# EAGLE design BiodataFeather_SymBioWare_001 (EAGLE 9.6.2)
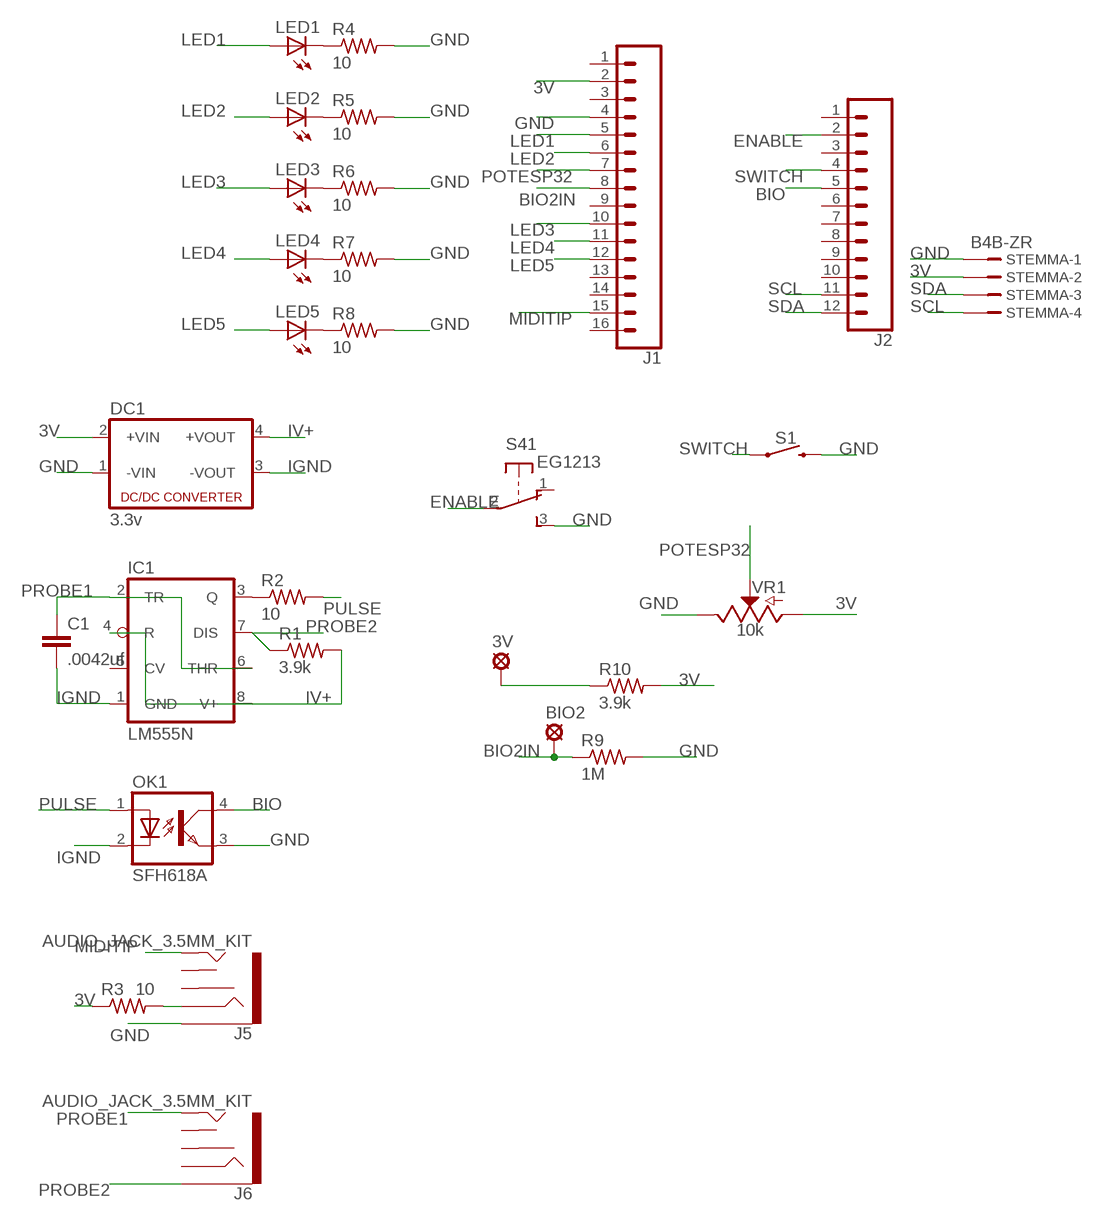
[diagram p0: schematic, sheet 1]

## Parts
3V  SE14  [SE14]
BIO2  SE14  [SE14]
C1  .0042uf  C2.5/2  [C2.5-2]
DC1  3.3v  NME  [NME]
IC1  LM555N  [DIL08]
J1  CONN_161X16_NO_SILK  [1X16_NO_SILK]
J2  CONN_12NO_SILK  [1X12_NO_SILK]
J5  AUDIO_JACK_3.5MM_KIT  [AUDIO-JACK-KIT]
J6  AUDIO_JACK_3.5MM_KIT  [AUDIO-JACK-KIT]
LED1  LED5MM  [LED5MM]
LED2  LED5MM  [LED5MM]
LED3  LED5MM  [LED5MM]
LED4  LED5MM  [LED5MM]
LED5  LED5MM  [LED5MM]
OK1  SFH618A  SFH618A-5  [DIP4]
R1  3.9k  R-US_0204/2V  [0204V]
R2  10  R-US_0204/2V  [0204V]
R3  10  R-US_0204/2V  [0204V]
R4  10  R-US_0204/2V  [0204V]
R5  10  R-US_0204/2V  [0204V]
R6  10  R-US_0204/2V  [0204V]
R7  10  R-US_0204/2V  [0204V]
R8  10  R-US_0204/2V  [0204V]
R9  1M  R-US_0204/2V  [0204V]
R10  3.9k  R-US_0204/2V  [0204V]
S1  MOMENTARY-SWITCH-SPST-PTH-6.0MM  [TACTILE_SWITCH_PTH_6.0MM]
S4  EG1213  [EG1213]
STEMMA  B4B-ZR  [B4B-ZR]
VR1  10k  POTENTIOMETER-PTH-9MM-1/20W-20%-KIT  [POT-PTH-ALPS-KIT]

## Nets
3V: DC1.2(+VIN) J1.2 R3.1 R10.2 STEMMA.2 VR1.P$3(A)
BIO: J2.5 OK1.4(COL)
BIO2IN: BIO2.MP J1.8 R9.1
ENABLE: J2.2 S4.2(1:P)
GND: DC1.1(-VIN) J1.4 J5.SLEEVE OK1.3(EMIT) R4.2 R5.2 R6.2 R7.2 R8.2 R9.2 S1.3 S4.3(1:S) STEMMA.1 VR1.P$1(E)
IGND: C1.2 DC1.3(-VOUT) IC1.1(GND) OK1.2(C)
IV+: DC1.4(+VOUT) IC1.4(R) IC1.8(V+) R1.2
LED1: J1.5 LED1.A
LED2: J1.6 LED2.A
LED3: J1.10 LED3.A
LED4: J1.11 LED4.A
LED5: J1.12 LED5.A
MIDITIP: J1.15 J5.TIP
N$1: IC1.3(Q) R2.1
N$2: J5.RING R3.2
N$3: LED1.K(C) R4.1
N$4: 3V.MP R10.1
N$8: LED2.K(C) R5.1
N$9: LED3.K(C) R6.1
N$10: LED4.K(C) R7.1
N$11: LED5.K(C) R8.1
POTESP32: J1.7 VR1.P$2(S)
PROBE1: C1.1 IC1.2(TR) IC1.6(THR) J6.TIP
PROBE2: IC1.7(DIS) J6.SLEEVE R1.1
PULSE: OK1.1(A) R2.2
SCL: J2.11 STEMMA.4
SDA: J2.12 STEMMA.3
SWITCH: J2.4 S1.1
Unconnected: IC1.5(CV) J1.1 J1.3 J1.9 J1.13 J1.14 J1.16 J2.1 J2.3 J2.6 J2.7 J2.8 J2.9 J2.10 J5.RSH J5.TSH J6.RING J6.RSH J6.TSH S4.1(1:O) S4.MT1(MT) S4.MT2(MT)

## Library data of the parts
3V BIO2 = solpad:SE14: SOLDER PAD E1553, drill 1,4mm, distributor Buerklin, 07F820
C1 = capacitor-wima:C: CAPACITOR naming: grid - package width
DC1 = dc-dc-converter:NME: DC-DC CONVERTER; MF: C & D TECHNOLOGIES, INC; MPN: NME1205D; OC_FARNELL: 1021466; OC_NEWARK: 98B8198
IC1 = linear:*555: TIMER
J1 = SparkFun-Connectors:CONN_16: Multi connection point. Often used as Generic Header-pin footprint for 0.1 inch spaced/style header connections On any of the 0.1 inch spaced packages, you can populate with these: Break Away Headers - Straight <https://www.sparkfun.com/products/116> (PRT-00116) Break Away Male Headers - Right Angle <https://www.sparkfun.com/products/553> (PRT-00553) Female Headers <https://www.sparkfun.com/products/115> (PRT-00115) Break Away Headers - Machine Pin <https://www.sparkfun.com/products/117> (PRT-00117) Break Away Female Headers - Swiss Machine Pin <https://www.sparkfun.com/products/743> (PRT-00743) For SCREWTERMINALS and SPRING TERMINALS visit here: Screw Terimnals on SparkFun.com <https://www.sparkfun.com/search/results?term=Screw+Terminals> (5mm/3.5mm/2.54mm spacing) This device is also useful as a general connection point to wire up your design to another part of your project. Our various solder wires solder well into these plated through hole pads. Hook-Up Wire - Assortment (Stranded, 22 AWG) <https://www.sparkfun.com/products/11375> (PRT-11375) Hook-Up Wire - Assortment (Solid Core, 22 AWG) <https://www.sparkfun.com/products/11367> (PRT-11367) View the entire wire category on our website here <https://www.sparkfun.com/categories/141> Special notes: Molex polarized connector foot print use with SKU : PRT-08231 with associated crimp pins and housings. 1MM SMD Version SKU: PRT-10208 NOTES ON THE VARIANTS LOCK and LOCK_LONGPADS... This footprint was designed to help hold the alignment of a through-hole component (i.e. 6-pin header) while soldering it into place. You may notice that each hole has been shifted either up or down by 0.005 of an inch from it's more standard position (which is a perfectly straight line). This slight alteration caused the pins (the squares in the middle) to touch the edges of the holes. Because they are alternating, it causes a "brace" to hold the component in place. 0.005 has proven to be the perfect amount of "off-center" position when using our standard breakaway headers. Although looks a little odd when you look at the bare footprint, once you have a header in there, the alteration is very hard to notice. Also,if you push a header all the way into place, it is covered up entirely on the bottom side.
J2 = SparkFun-Connectors:CONN_12: Multi connection point. Often used as Generic Header-pin footprint for 0.1 inch spaced/style header connections On any of the 0.1 inch spaced packages, you can populate with these: Break Away Headers - Straight <https://www.sparkfun.com/products/116> (PRT-00116) Break Away Male Headers - Right Angle <https://www.sparkfun.com/products/553> (PRT-00553) Female Headers <https://www.sparkfun.com/products/115> (PRT-00115) Break Away Headers - Machine Pin <https://www.sparkfun.com/products/117> (PRT-00117) Break Away Female Headers - Swiss Machine Pin <https://www.sparkfun.com/products/743> (PRT-00743) For SCREWTERMINALS and SPRING TERMINALS visit here: Screw Terimnals on SparkFun.com <https://www.sparkfun.com/search/results?term=Screw+Terminals> (5mm/3.5mm/2.54mm spacing) This device is also useful as a general connection point to wire up your design to another part of your project. Our various solder wires solder well into these plated through hole pads. Hook-Up Wire - Assortment (Stranded, 22 AWG) <https://www.sparkfun.com/products/11375> (PRT-11375) Hook-Up Wire - Assortment (Solid Core, 22 AWG) <https://www.sparkfun.com/products/11367> (PRT-11367) View the entire wire category on our website here <https://www.sparkfun.com/categories/141> Special notes: Molex polarized connector foot print use with SKU : PRT-08231 with associated crimp pins and housings. 1MM SMD Version SKU: PRT-10208 NOTES ON THE VARIANTS LOCK and LOCK_LONGPADS... This footprint was designed to help hold the alignment of a through-hole component (i.e. 6-pin header) while soldering it into place. You may notice that each hole has been shifted either up or down by 0.005 of an inch from it's more standard position (which is a perfectly straight line). This slight alteration caused the pins (the squares in the middle) to touch the edges of the holes. Because they are alternating, it causes a "brace" to hold the component in place. 0.005 has proven to be the perfect amount of "off-center" position when using our standard breakaway headers. Although looks a little odd when you look at the bare footprint, once you have a header in there, the alteration is very hard to notice. Also,if you push a header all the way into place, it is covered up entirely on the bottom side.
J5 J6 = SparkFun-Connectors:AUDIO_JACK_3.5MM: Audio Jack 3.5mm variants of PTH and SMT stereo audio jack with bypass switches. SparkFun Products: SparkFun SparkPunk Sound Kit <[https://www.sparkfun.com/products/11177]> - PTH MP3 Trigger <https://www.sparkfun.com/products/13720> -3.5mm SMD SparkFun PicoBoard <https://www.sparkfun.com/products/11888>- 2.5mm SMD; PROD_ID: CONN-08774; SF_ID: PRT-08032
LED1-LED5 = led:LED: LED OSRAM: - CHIPLED LG R971, LG N971, LY N971, LG Q971, LY Q971, LO R971, LY R971 LH N974, LH R974 LS Q976, LO Q976, LY Q976 LO Q996 - Hyper CHIPLED LW Q18S LB Q993, LB Q99A, LB R99A - SideLED LS A670, LO A670, LY A670, LG A670, LP A670 LB A673, LV A673, LT A673, LW A673 LH A674 LY A675 LS A676, LA A676, LO A676, LY A676, LW A676 LS A679, LY A679, LG A679 - Hyper Micro SIDELED® LS Y876, LA Y876, LO Y876, LY Y876 LT Y87S - SmartLED LW L88C, LW L88S LB L89C, LB L89S, LG L890 LS L89K, LO L89K, LY L89K LS L896, LA L896, LO L896, LY L896 - TOPLED LS T670, LO T670, LY T670, LG T670, LP T670 LSG T670, LSP T670, LSY T670, LOP T670, LYG T670 LG T671, LOG T671, LSG T671 LB T673, LV T673, LT T673, LW T673 LH T674 LS T676, LA T676, LO T676, LY T676, LB T676, LH T676, LSB T676, LW T676 LB T67C, LV T67C, LT T67C, LS T67K, LO T67K, LY T67K, LW E67C LS E67B, LA E67B, LO E67B, LY E67B, LB E67C, LV E67C, LT E67C LW T67C LS T679, LY T679, LG T679 LS T770, LO T770, LY T770, LG T770, LP T770 LB T773, LV T773, LT T773, LW T773 LH T774 LS E675, LA E675, LY E675, LS T675 LS T776, LA T776, LO T776, LY T776, LB T776 LHGB T686 LT T68C, LB T68C - Hyper Mini TOPLED® LB M676 - Mini TOPLED Santana® LG M470 LS M47K, LO M47K, LY M47K Source: http://www.osram.convergy.de LUXEON: - LUMILED® LXK2-PW12-R00, LXK2-PW12-S00, LXK2-PW14-U00, LXK2-PW14-V00 LXK2-PM12-R00, LXK2-PM12-S00, LXK2-PM14-U00 LXK2-PE12-Q00, LXK2-PE12-R00, LXK2-PE12-S00, LXK2-PE14-T00, LXK2-PE14-U00 LXK2-PB12-K00, LXK2-PB12-L00, LXK2-PB12-M00, LXK2-PB14-N00, LXK2-PB14-P00, LXK2-PB14-Q00 LXK2-PR12-L00, LXK2-PR12-M00, LXK2-PR14-Q00, LXK2-PR14-R00 LXK2-PD12-Q00, LXK2-PD12-R00, LXK2-PD12-S00 LXK2-PH12-R00, LXK2-PH12-S00 LXK2-PL12-P00, LXK2-PL12-Q00, LXK2-PL12-R00 Source: www.luxeon.com KINGBRIGHT: KA-3528ASYC Source: www.kingbright.com
OK1 = optocoupler:SFH618?*: Optocoupler, Phototransistor Output, Low Input Current Source: Data sheet <http://www.vishay.com/docs/83673/sfh618.pdf>; MF: VISHAY/TELEFUNKEN; MPN: SFH618A-5; OC_FARNELL: 1469593; OC_NEWARK: 59K0259
R1-R10 = rcl:R-US_: RESISTOR, American symbol
S1 = SparkFun-Switches:MOMENTARY-SWITCH-SPST: Momentary Switch (Pushbutton) - SPST Normally-open (NO) SPST momentary switches (buttons, pushbuttons). Variants PTH-12MM - 12mm square, through-hole Momentary Pushbutton Switch - 12mm Square <https://www.sparkfun.com/products/9190> (COM-09190) PTH-6.0MM, PTH-6.0MM-KIT - 6.0mm square, through-hole Mini Pushbutton Switch <https://www.sparkfun.com/products/97> (COM-00097) KIT package intended for soldering kit's - only one side of pads' copper is exposed. PTH-RIGHT-ANGLE-KIT - Right-angle, through-hole Right Angle Tactile Button <https://www.sparkfun.com/products/10791> - Used on SparkFun BigTime Watch Kit <https://www.sparkfun.com/products/11734> SMD-12MM - 12mm square, surface-mount Tactile Button - SMD (12mm) <https://www.sparkfun.com/products/12993> (COM-12993) Used on SparkFun PicoBoard <https://www.sparkfun.com/products/11888> SMD-4.5MM - 4.5mm Square Trackball Switch Used on SparkFun Blackberry Trackballer Breakout <https://www.sparkfun.com/products/13169> SMD-4.6MMX2.8MM - 4.60mm x 2.80mm, surface mount Used on SparkFun SAMD21 Mini Breakout <https://www.sparkfun.com/products/13664> SMD-5.2MM, SMD-5.2-REDUNDANT - 5.2mm square, surface-mount Mini Pushbutton Switch - SMD <https://www.sparkfun.com/products/8720> (COM-08720) Used on Arduino Pro Mini <https://www.sparkfun.com/products/11114> REDUNDANT package connects both switch circuits together SMD-6.0X3.5MM - 6.0 x 3.5mm, surface mount Momentary Reset Switch SMD <https://www.sparkfun.com/products/8229> (COM-08229) SMD-6.2MM-TALL - 6.2mm square, surface mount Tactile Button - SMD (6mm) <https://www.sparkfun.com/products/12992> Used on SparkFun Digital Sandbox <https://www.sparkfun.com/products/12651> SMD-RIGHT-ANGLE - Right-angle, surface mount Used on SparkFun Block for Intel® Edison - Arduino <https://www.sparkfun.com/products/13036>; PROD_ID: SWCH-08441; SF_SKU: COM-00097
S4 = adafruit:EG1213: E-Switch right-angle slide SPDT Part #EG1213 http://www.ladyada.net/library/eagle
STEMMA = con-jst:?4B-ZR: ZH CONNECTOR 1.5 mm, 4 pin 1 row Source: http://www.jst.com .. eZH.pdf; MF: FARNELL; MPN: B4B-ZR(LF)(SN); OC_FARNELL: 1830916; OC_NEWARK: 37K9960
VR1 = SparkFun-Resistors:POTENTIOMETER: Potentiometer (Pot) Three-terminal potentiometers, with an adjustable wiper and two adjustable resistors. A pot can be used to create a configurable voltage divider, or as a variable resistor. Variants ALPS_POT and ALPS_POT_KIT - PTH, breadboard compatible, 9mm square pots Rotary Potentiometer - Linear (10k ohm) <https://www.sparkfun.com/products/9288> (COM-09288) The KIT variant exposes copper on only one side of the PTH pad, so the part can only be assembled on one side of the PCB. Useful for beginner soldering kits.; PROD_ID: RES-09177; SF_SKU: COM-09288

## Board
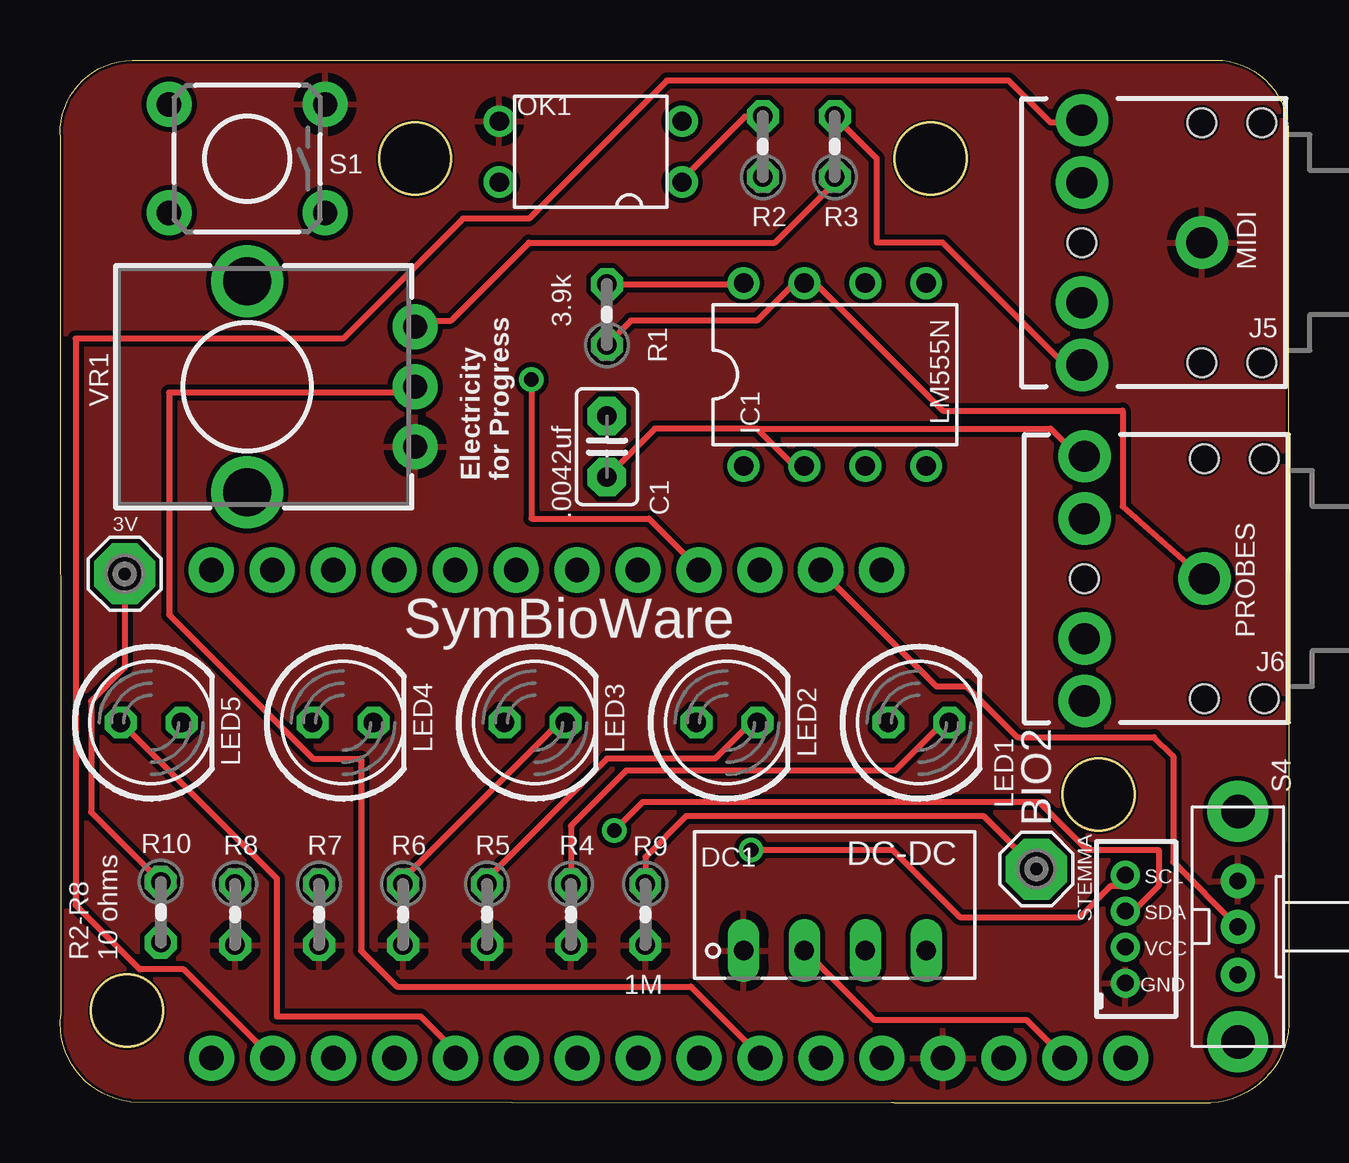
[diagram p1: board, top side]
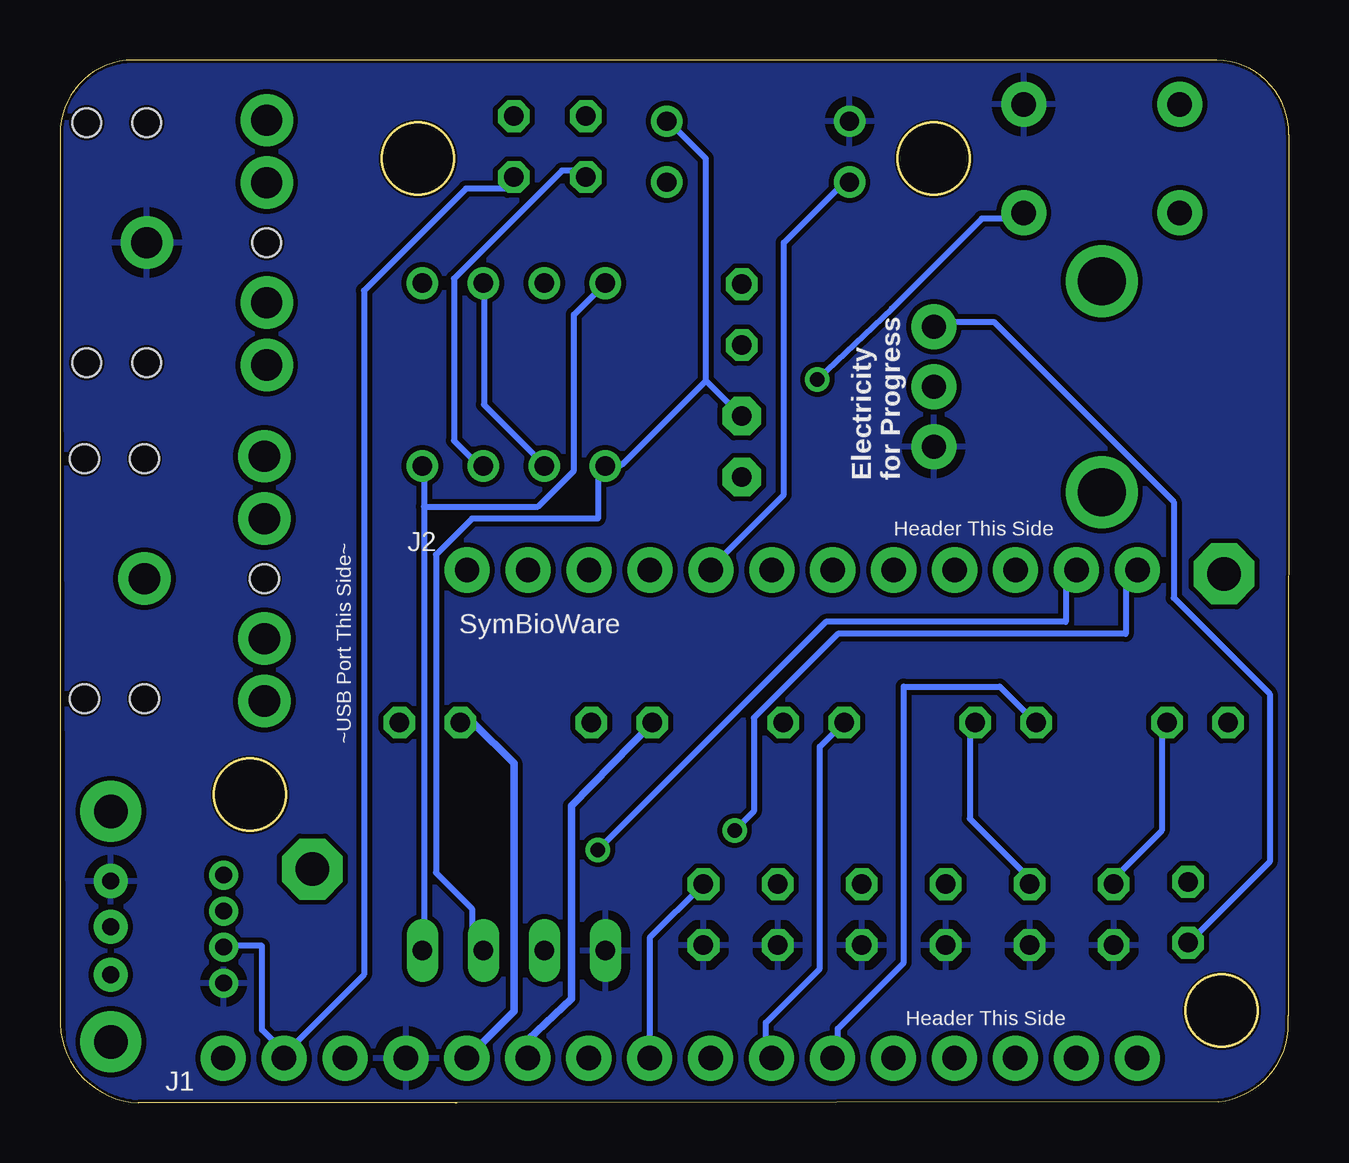
[diagram p2: board, bottom side, seen from below]

Size 51.22 x 43.45 mm. Coordinates in mm from the lower left corner, seen from the top.
Outline: 34.76,0 2.93,0.05 arc-90 0.03,3.62 0,40.34 arc-90 3,43.44 47.9,43.44 arc-90 51.2,40.64 51.22,3.58 arc-90 47.96,0 34.76,0
Outline: 34.76,0 34.66,0
Outline: circle at 14.8,39.34 radius 1.5
Outline: circle at 36.3,39.34 radius 1.5
Outline: circle at 43.3,12.84 radius 1.5
Outline: circle at 2.8,3.84 radius 1.5
Copper layers (1*16): Top 0.035mm / dielectric 1.5mm / Bottom 0.035mm
Design rules "default *": minimum track width 10mil, minimum drill 24mil, track to track 8mil, track to pad 8mil, pad to pad 8mil, via to via 8mil, smd to smd 8mil, copper to edge 5mil, drill to drill 8mil, minimum pad ring 10mil, minimum via ring 8mil, stop-mask expansion 4mil, vias tented up to drill 0mil, thermal gap 15mil

### Footprints (pad centres in the part's own frame; a part is rotated, then mirrored left to right if it is on the bottom)
SE14 = drill 1.397 pad 2.54 octagon: MP 0,0
C2.5-2 = drill 0.813 pad 1.6 octagon: 1 -1.27,0; 2 1.27,0
NME = drill 0.813 long: 1 0,3.81; 2 0,1.27; 3 0,-1.27; 4 0,-3.81
DIL08 = drill 0.813 pad 1.27: 1 -3.81,-3.81; 2 -1.27,-3.81; 3 1.27,-3.81; 4 3.81,-3.81; 5 3.81,3.81; 6 1.27,3.81; 7 -1.27,3.81; 8 -3.81,3.81
1X16_NO_SILK = drill 1.016 pad 1.88: 1 0,0; 2 2.54,0; 3 5.08,0; 4 7.62,0; 5 10.16,0; 6 12.7,0; 7 15.24,0; 8 17.78,0; 9 20.32,0; 10 22.86,0; 11 25.4,0; 12 27.94,0; 13 30.48,0; 14 33.02,0; 15 35.56,0; 16 38.1,0
1X12_NO_SILK = drill 1.016 pad 1.88: 1 0,0; 2 2.54,0; 3 5.08,0; 4 7.62,0; 5 10.16,0; 6 12.7,0; 7 15.24,0; 8 17.78,0; 9 20.32,0; 10 22.86,0; 11 25.4,0; 12 27.94,0
AUDIO-JACK-KIT = drill 1.3 pad 2.184: RING 5,5.1; RSH 5,2.5; SLEEVE 0,0; TIP 5,-5.1; TSH 5,-2.5 | hole 1.2: 0,5; -2.5,5; -2.5,-5; 0,-5; 5,0
LED5MM = drill 0.813 octagon: A -1.27,0; K 1.27,0
DIP4 = drill 0.8: 1 -1.27,-3.81; 2 1.27,-3.81; 3 1.27,3.81; 4 -1.27,3.81
0204V = drill 0.813 octagon: 1 -1.27,0; 2 1.27,0
TACTILE_SWITCH_PTH_6.0MM = drill 1.016 pad 1.88: 1 -3.251,2.261; 2 3.251,2.261; 3 -3.251,-2.261; 4 3.251,-2.261
EG1213 = drill 0.7 pad 1.422: 1 -2,0; 2 0,0; 3 1.9,0 | drill 1.4 pad 2.54: MT1 -4.8,0; MT2 4.8,0
B4B-ZR = drill 0.7 pad 1.1: 1 -2.25,0; 2 -0.75,0; 3 0.75,0; 4 2.25,0
POT-PTH-ALPS-KIT = drill 1 pad 1.88: P$1 7,-2.5; P$2 7,0; P$3 7,2.5 | drill 2: P$4 0,-4.4; P$5 0,4.4

### Placement (x,y rotation side)
3V  2.7,22.04 0 top
BIO2  40.7,9.74 0 top
C1  22.8,27.34 90 top
DC1  32.3,6.34 90 top
IC1  32.3,30.34 0 top
J1  44.42,1.86 180 top
J2  34.25,22.2 180 top
J5  47.6,35.84 180 top
J6  47.7,21.84 180 top
LED1  35.8,15.84 0 top
LED2  27.8,15.84 0 top
LED3  19.8,15.84 0 top
LED4  11.8,15.84 0 top
LED5  3.8,15.84 0 top
OK1  22.12,39.63 90 top
R1  22.8,32.84 90 top
R2  29.3,39.84 90 top
R3  32.3,39.84 90 top
R4  21.3,7.84 270 top
R5  17.8,7.84 270 top
R6  14.3,7.84 270 top
R7  10.8,7.84 270 top
R8  7.3,7.84 270 top
R9  24.4,7.84 270 top
R10  4.2,7.94 270 top
S1  7.8,39.34 180 top
S4  49.1,7.34 90 top
STEMMA  44.4,7.24 90 top
VR1  7.8,29.84 0 top

### Tracks (layer width: path | path; a pad name or v marks a point on that pad's centre or on a via)
3V
  Top 0.254: J1.2 40.3,3.44 33.95,3.44 31.05,6.34 DC1.2 | VR1.P$3 15.05,32.59 16.3,32.59 19.55,35.84 29.8,35.84 32.3,38.34 R3.1
  Bottom 0.254: R3.1 32.3,38.09 34.3,38.09 38.55,33.84 38.55,5.34 41.8,2.09 J1.2 42.3,2.04 42.3,2.54 42.8,3.04 42.8,6.54 44.3,6.54 STEMMA.2 | R10.2 3.8,7.04 0.8,10.04 0.8,17.04 4.8,21.04 4.8,25.04 12.3,32.54 14.8,32.54 VR1.P$3
BIO
  Bottom 0.254: OK1.4 18.55,38.34 21.05,35.84 21.05,25.34 24.05,22.34 J2.5
BIO2IN
  Top 0.254: BIO2.MP 38.5,11.94 26.1,11.94 24.4,10.24 R9.1
  Bottom 0.254: R9.1 26.64,6.87 J1.8
ENABLE
  Top 0.254: S4.2 46.4,10.04 46.4,14.44 45.6,15.24 39.9,15.24 37.8,17.34 36.55,17.34 31.8,22.09 J2.2
GND
  pour Top (rank 2): -0.15,-0.04 50.96,-0.02 51,43.42 0,43.44 -0.04,9.2
  pour Bottom: -0.14,-0.1 50.84,-0.1 50.98,43.54 0,43.54
IGND
  Bottom 0.254: 24.3,30.09 24.3,39.34 25.8,40.84 OK1.2 | 24.3,30.09 22.8,28.59 C1.2 | DC1.3 33.8,6.34 34.05,6.59 34.05,8.09 35.55,9.59 35.55,22.84 34.05,24.34 28.8,24.34 28.8,26.09 28.55,26.34 IC1.1 28.3,26.59 27.8,26.59 24.3,30.09
IV+
  Top 0.254: R1.2 22.8,34.09 28.3,34.09 IC1.8
  Bottom 0.254: 36.05,24.84 36.05,26.34 IC1.4 | 36.05,24.84 36.05,6.34 DC1.4 | IC1.8 29.8,32.84 29.8,26.34 31.3,24.84 36.05,24.84
LED1
  Bottom 0.305: LED1.A 34,15.84 32.3,14.14 32.3,3.82 J1.5
LED2
  Bottom 0.305: J1.6 31.72,2.62 29.9,4.34 29.9,12.37 LED2.A
LED3
  Bottom 0.254: LED3.A 18.55,15.84 19.55,14.84 19.55,5.59 21.8,3.34 21.8,2.09 J1.10
LED4
  Bottom 0.254: LED4.A 10.55,15.84 12.05,17.34 16.05,17.34 16.05,5.84 18.8,3.09 18.8,2.09 J1.11
LED5
  Top 0.254: LED5.A 2.55,15.84 9.05,9.34 9.05,3.59 15.05,3.59 16.55,2.09 J1.12
MIDITIP
  Top 0.254: J1.15 5.16,5.56 3.33,5.56 0.65,8.24 0.65,31.84 11.8,31.84 16.8,36.84 19.55,36.84 25.3,42.59 39.55,42.59 41.3,40.84 42.3,40.84 J5.TIP
N$1
  Bottom 0.254: R2.1 29.3,38.84 30.3,38.84 34.8,34.34 34.8,27.59 33.8,26.59 IC1.3
N$2
  Top 0.254: R3.2 32.3,41.09 34.05,39.34 34.05,35.84 36.8,35.84 41.8,30.84 42.3,30.84 J5.RING
N$3
  Top 0.254: LED1.K 36.8,15.84 34.8,13.84 23.6,13.84 21.3,11.54 R4.1
N$4
  Top 0.254: 3V.MP 2.7,18.14 1.3,16.74 1.3,12.11 R10.1
N$8
  Top 0.254: LED2.K 28.8,15.84 27.3,14.34 22.8,14.34 17.8,9.34 R5.1
N$9
  Top 0.254: LED3.K 20.8,15.84 14.3,9.34 R6.1
N$10
  Bottom 0.254: R7.1 10.8,9.34 13.3,11.84 13.3,15.84 LED4.K
N$11
  Bottom 0.254: R8.1 7.3,9.34 5.3,11.34 5.3,15.84 LED5.K
POTESP32
  Top 0.254: VR1.P$2 14.55,29.59 4.55,29.59 4.55,20.34 10.55,14.34 12.55,14.34 12.55,6.34 14.05,4.84 26.3,4.84 29.05,2.09 J1.7
PROBE1
  Top 0.254: 29.05,28.09 24.8,28.09 22.8,26.09 C1.1 | 29.05,28.09 30.55,26.59 30.8,26.59 IC1.2 | 29.05,28.09 41.3,28.09 42.3,27.09 J6.TIP
  Bottom 0.254: IC1.2 31.05,26.59 33.55,29.09 33.55,34.09 IC1.6
PROBE2
  Top 0.254: R1.1 22.8,31.59 23.8,32.59 29.05,32.59 30.55,34.09 30.8,34.09 IC1.7 31.05,34.09 31.55,34.09 36.8,28.84 44.3,28.84 44.3,24.84 J6.SLEEVE
PULSE
  Top 0.254: OK1.1 26.05,38.59 28.55,41.09 29.3,41.09 R2.2
SCL  (via drill 0.61)
  Top 0.254: v28.8,10.54 34.7,10.54 37.5,7.74 42.5,7.74 43.8,9.04 44.3,9.04 STEMMA.4
  Bottom 0.254: v28.8,10.54 19.3,20.04 9.3,20.04 9.3,22.04 J2.11
SDA  (via drill 0.61)
  Top 0.254: v23.1,11.34 24.3,12.54 40.8,12.54 42.8,10.54 45.8,10.54 45.8,9.04 44.8,8.04 STEMMA.3
  Bottom 0.254: v23.1,11.34 22.3,12.14 22.3,16.04 18.8,19.54 6.8,19.54 6.8,22.04 J2.12
SWITCH  (via drill 0.61)
  Top 0.254: v19.65,30.14 19.65,24.34 24.55,24.34 26.55,22.34 J2.4
  Bottom 0.254: v19.65,30.14 16.55,33.09 12.8,36.84 11.3,36.84 S1.1

### Text on the board
tNames: MIDI | Electricity / for Progress | PROBES | SymBioWare | SCL | SDA | R2-R8 / 10 ohms | VCC | GND
bNames: Electricity / for Progress | Header This Side | ~USB Port This Side~ | SymBioWare | Header This Side
tStop: SBW_001 | 2022
bStop: SBW_001 | 2022